# EasyEDA schematic SCH_自制基于ESP32的NES游戏掌机_2022-10-13.json

## Sheets
1 主板: TITLE: ESP32-NES游戏机; REV: 1.0; Date: 2020-06-22; Sheet: 1/1; Drawn By: micespring; Company: Your Company
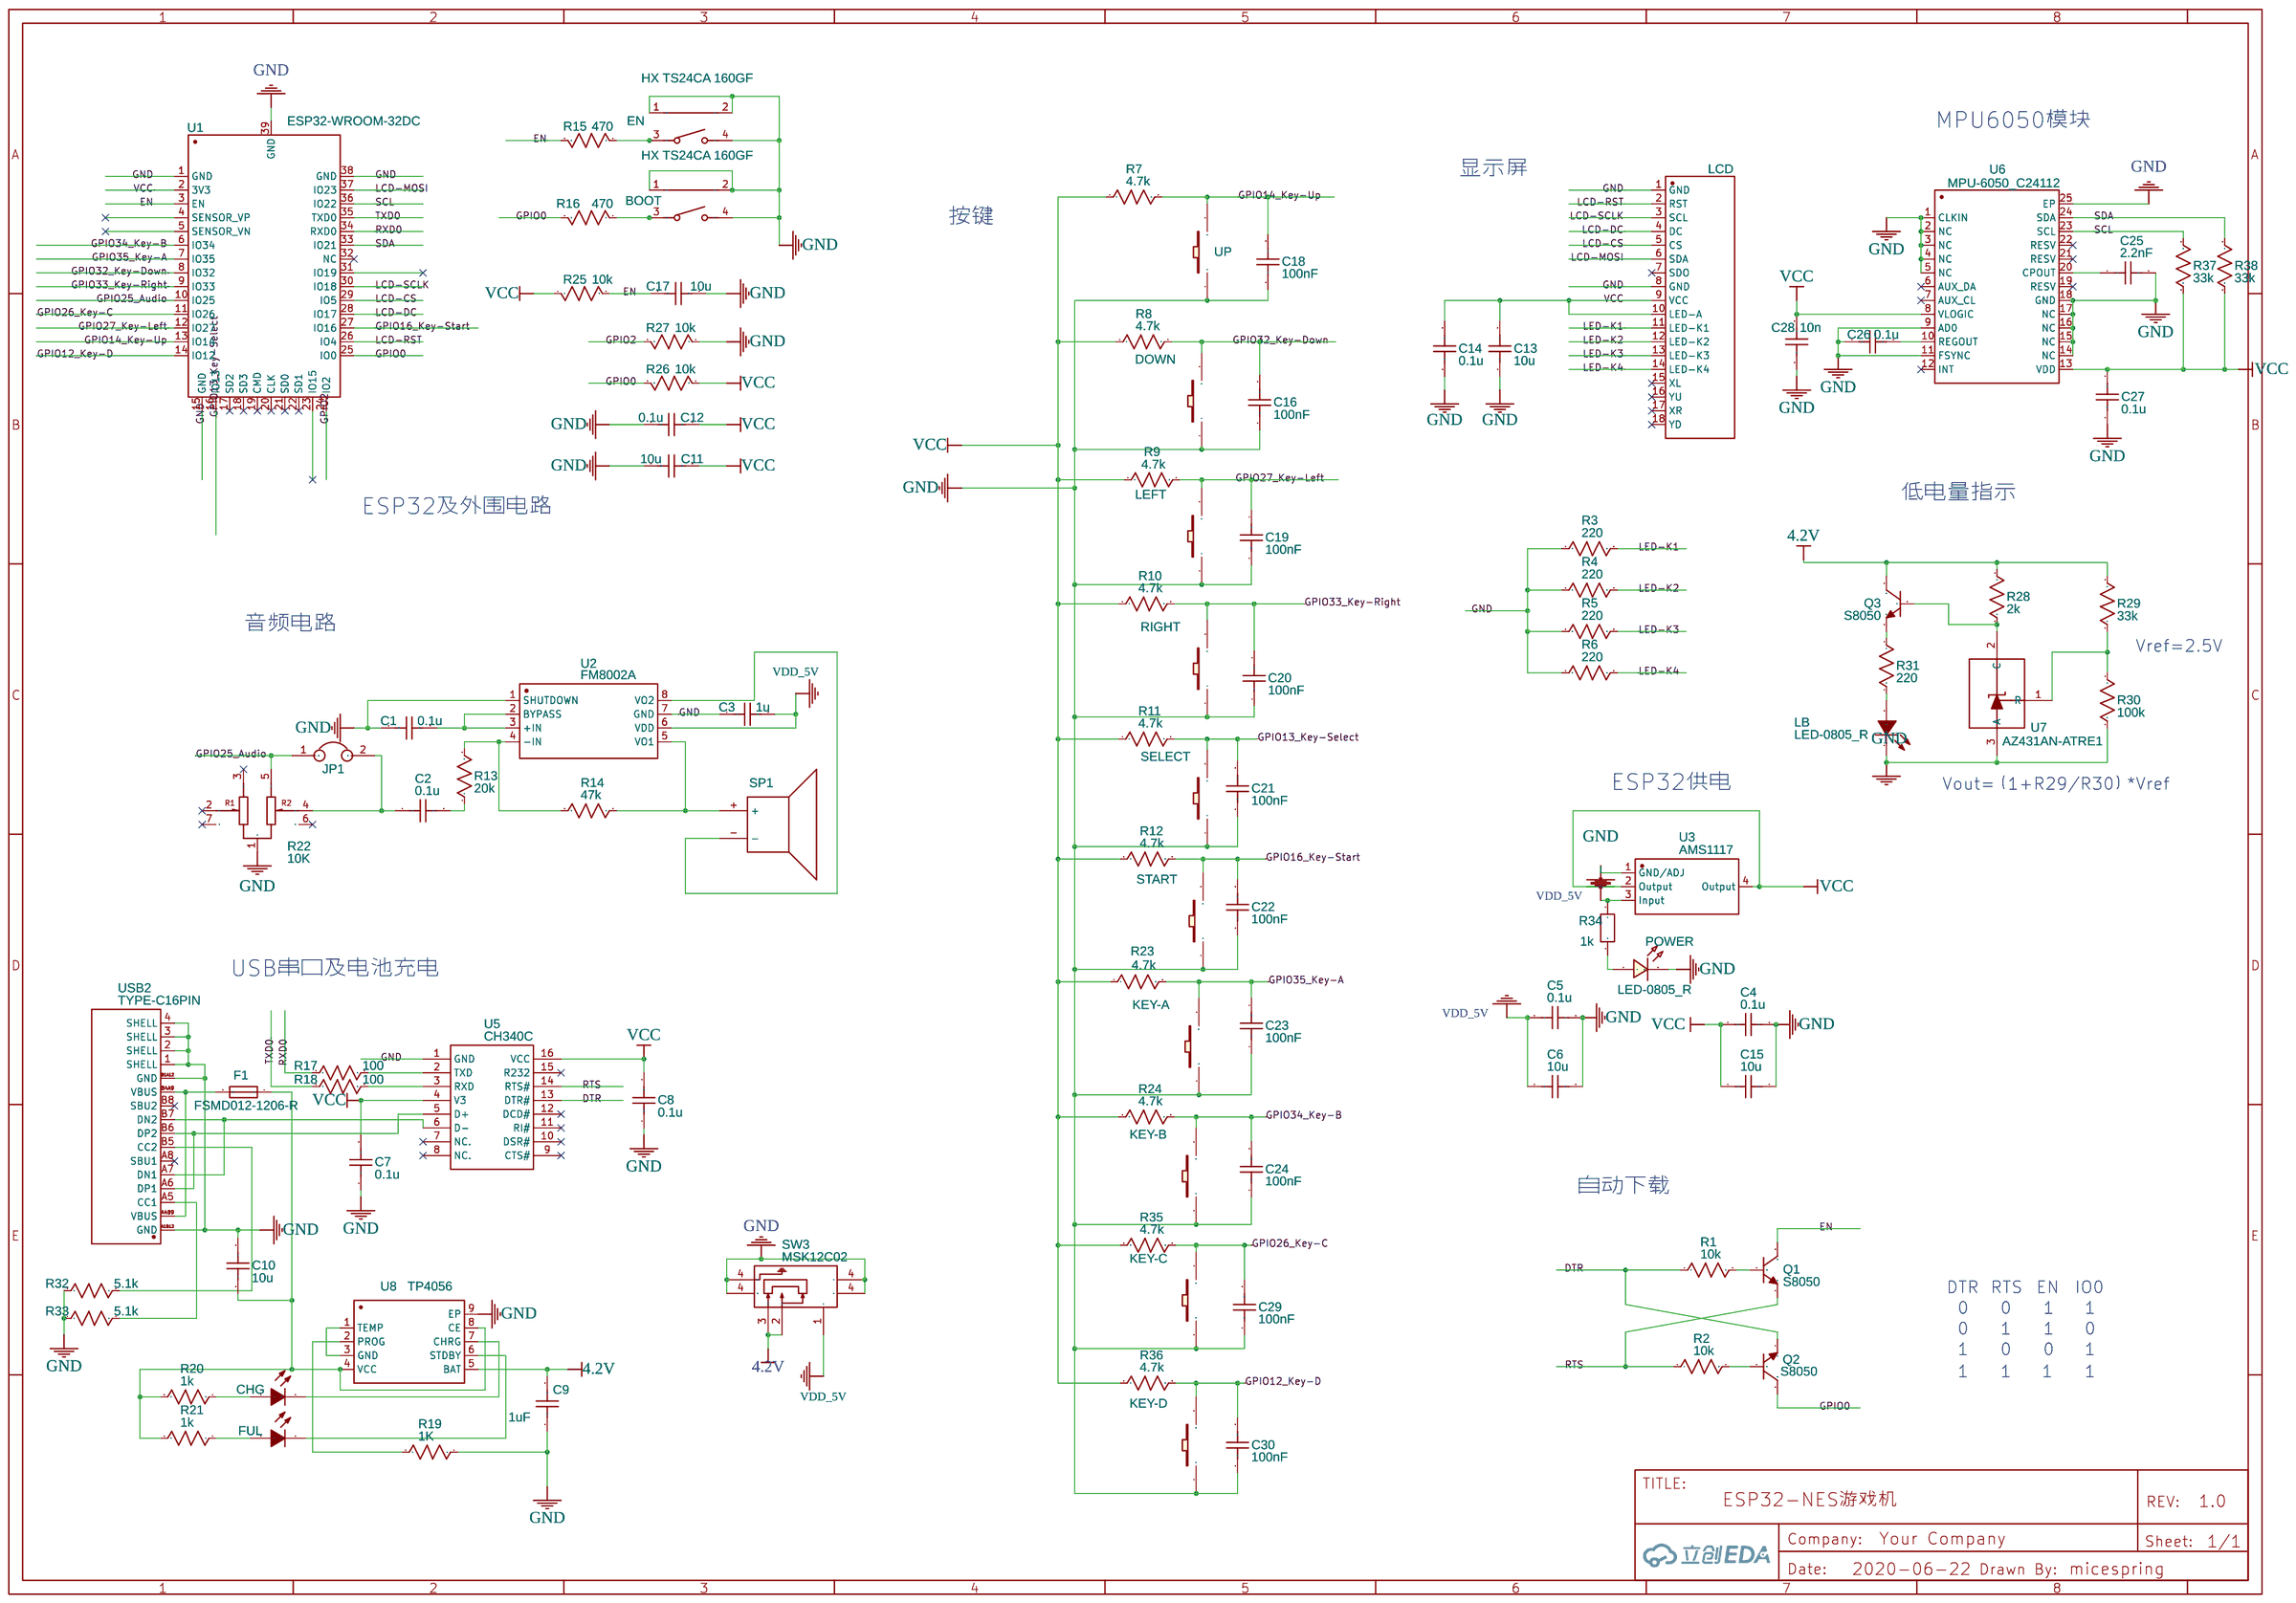
[diagram p0: 主板]
2 新主板
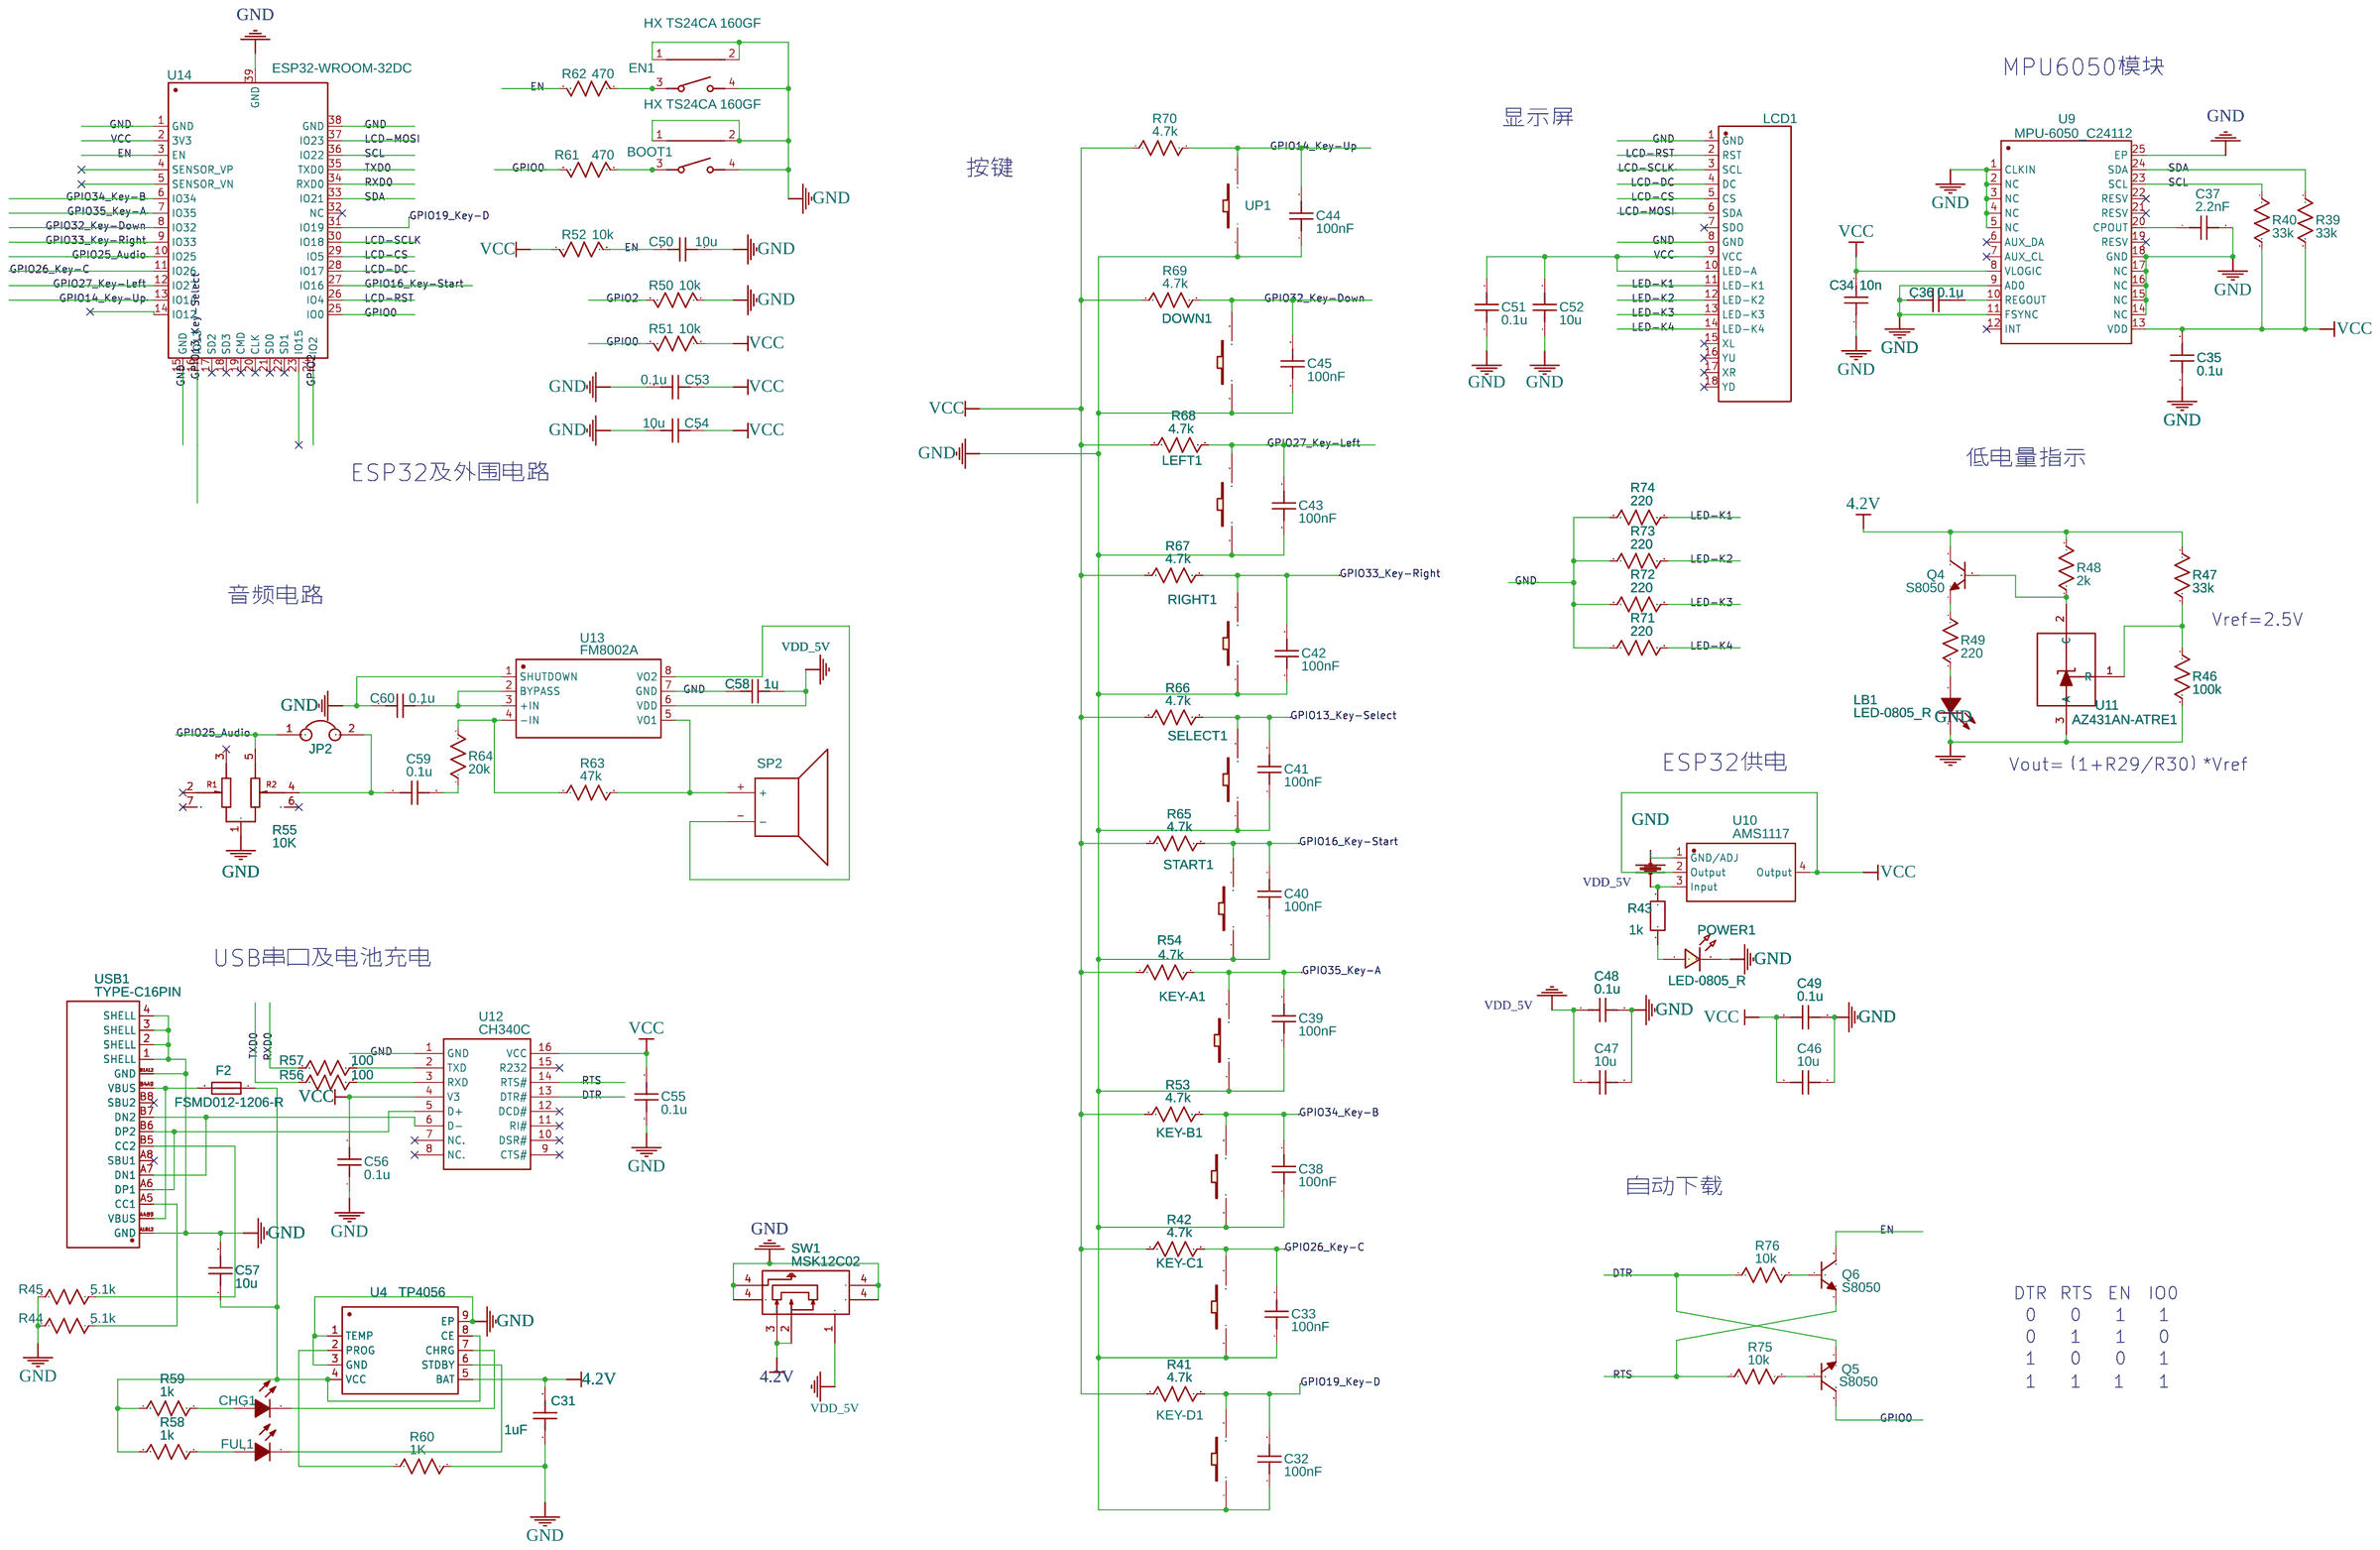
[diagram p1: 新主板]

## Parts
sheet 主板
BOOT  HX TS24CA 160GF  [SW-SMD_TS24CA]
C1  0.1u  [C0805]
C2  0.1u  [C0805]
C3  1u  [C0805]
C4  0.1u  [C0805]
C5  0.1u  [C0805]
C6  10u  [C0805]
C7  0.1u  [C0805]
C8  0.1u  [C0805]
C9  1uF  [C0805]
C10  10u  [C1206]
C11  10u  [C1206]
C12  0.1u  [C0805]
C13  10u  [C0805]
C14  0.1u  [C0805]
C15  10u  [C0805]
C16  100nF  [C0805]
C17  10u  [C0805]
C18  100nF  [C0805]
C19  100nF  [C0805]
C20  100nF  [C0805]
C21  100nF  [C0805]
C22  100nF  [C0805]
C23  100nF  [C0805]
C24  100nF  [C0805]
C25  2.2nF  [C0805]
C26  0.1u  [C0805]
C27  0.1u  [C0805]
C28  10n  [C0805]
C29  100nF  [C0805]
C30  100nF  [C0805]
CHG  17-21/BHC-XL2M2TY/3T  [LED0805_RED]
DOWN  K2-1817UQ-C4SW-01  [KEY-SMD_2P-L6.0-W6.0-P6.00]
EN  HX TS24CA 160GF  [SW-SMD_TS24CA]
F1  FSMD012-1206-R  [F1206]
FUL  17-21/BHC-XL2M2TY/3T  [LED0805_GREEN]
JP1  JUMPER  [JUMPER-0603]
KEY-A  K2-1817UQ-C4SW-01  [KEY-SMD_2P-L6.0-W6.0-P6.00]
KEY-B  K2-1817UQ-C4SW-01  [KEY-SMD_2P-L6.0-W6.0-P6.00]
KEY-C  K2-1817UQ-C4SW-01  [KEY-SMD_2P-L6.0-W6.0-P6.00]
KEY-D  K2-1817UQ-C4SW-01  [KEY-SMD_2P-L6.0-W6.0-P6.00]
LB  LED-0805_R  [LED0805_RED]
LCD  TFT_2.4_18P_SPI_ILI9341_240X320_65K_S  [TFT_2.4_18P_SPI_ILI9341_240X320_65K_S]
LEFT  K2-1817UQ-C4SW-01  [KEY-SMD_2P-L6.0-W6.0-P6.00]
POWER  LED-0805_R  [LED0805_RED]
Q1  S8050  [SOT-23-3_L2.9-W1.3-P1.90-LS2.4-TR]
Q2  S8050  [SOT-23-3_L2.9-W1.3-P1.90-LS2.4-TR]
Q3  S8050  [SOT-23-3_L2.9-W1.3-P1.90-LS2.4-TR]
R1  10k  [R0805]
R2  10k  [R0805]
R3  220  [R0805]
R4  220  [R0805]
R5  220  [R0805]
R6  220  [R0805]
R7  4.7k  [R0805]
R8  4.7k  [R0805]
R9  4.7k  [R0805]
R10  4.7k  [R0805]
R11  4.7k  [R0805]
R12  4.7k  [R0805]
R13  20k  [R0805]
R14  47k  [R0805]
R15  470  [R0805]
R16  470  [R0805]
R17  100  [R0805]
R18  100  [R0805]
R19  1K  [R0805]
R20  1k  [R0805]
R21  1k  [R0805]
R22  10K  [RES-TH_RK10J12E002L]
R23  4.7k  [R0805]
R24  4.7k  [R0805]
R25  10k  [R0805]
R26  10k  [R0805]
R27  10k  [R0805]
R28  2k  [R0805]
R29  33k  [R0805]
R30  100k  [R0805]
R31  220  [R0805]
R32  5.1k  [R0805]
R33  5.1k  [R0805]
R34  1k  [R0805]
R35  4.7k  [R0805]
R36  4.7k  [R0805]
R37  33k  [R0805]
R38  33k  [R0805]
RIGHT  K2-1817UQ-C4SW-01  [KEY-SMD_2P-L6.0-W6.0-P6.00]
SELECT  K2-1817UQ-C4SW-01  [KEY-SMD_2P-L6.0-W6.0-P6.00]
SP1  SPEAKER-FS-2308-P9.2  [SPEAKER-FS-2308-P9.2-PCB]
START  K2-1817UQ-C4SW-01  [KEY-SMD_2P-L6.0-W6.0-P6.00]
SW3  MSK12C02  [SW-TH_MSK12C02]
U1  ESP32-WROOM-32DC  [WIFIM-SMD_38P-L25.5-W18.0-P1.27]
U2  FM8002A  [SOP-8_L4.9-W3.9-P1.27-LS6.0-BL]
U3  AMS1117  [SOT-223-4_L6.5-W3.5-P2.30-LS7.0-BR]
U5  CH340C  [SOP-16_L10.0-W3.9-P1.27-LS6.0-BL]
U6  MPU-6050_C24112  [QFN-24_L4.0-W4.0-P0.50-BL-EP2.6]
U7  AZ431AN-ATRE1  [SOT-23-3_L2.9-W1.6-P1.90-LS2.8-BR]
U8  TP4056  [ESOP-8_L4.9-W3.9-P1.27-LS6.0-BL-EP]
UP  K2-1817UQ-C4SW-01  [KEY-SMD_2P-L6.0-W6.0-P6.00]
USB2  TYPE-C16PIN  [USB-C-SMD_TYPE-C16PIN]
sheet 新主板
BOOT1  HX TS24CA 160GF  [SW-SMD_TS24CA]
C31  1uF  [C0805]
C32  100nF  [C0805]
C33  100nF  [C0805]
C34  10n  [C0805]
C35  0.1u  [C0805]
C36  0.1u  [C0805]
C37  2.2nF  [C0805]
C38  100nF  [C0805]
C39  100nF  [C0805]
C40  100nF  [C0805]
C41  100nF  [C0805]
C42  100nF  [C0805]
C43  100nF  [C0805]
C44  100nF  [C0805]
C45  100nF  [C0805]
C46  10u  [C0805]
C47  10u  [C0805]
C48  0.1u  [C0805]
C49  0.1u  [C0805]
C50  10u  [C0805]
C51  0.1u  [C0805]
C52  10u  [C0805]
C53  0.1u  [C0805]
C54  10u  [C1206]
C55  0.1u  [C0805]
C56  0.1u  [C0805]
C57  10u  [C1206]
C58  1u  [C0805]
C59  0.1u  [C0805]
C60  0.1u  [C0805]
CHG1  17-21/BHC-XL2M2TY/3T  [LED0805_RED]
DOWN1  K2-1817UQ-C4SW-01  [KEY-SMD_2P-L6.0-W6.0-P6.00]
EN1  HX TS24CA 160GF  [SW-SMD_TS24CA]
F2  FSMD012-1206-R  [F1206]
FUL1  17-21/BHC-XL2M2TY/3T  [LED0805_GREEN]
JP2  JUMPER  [JUMPER-0603]
KEY-A1  K2-1817UQ-C4SW-01  [KEY-SMD_2P-L6.0-W6.0-P6.00]
KEY-B1  K2-1817UQ-C4SW-01  [KEY-SMD_2P-L6.0-W6.0-P6.00]
KEY-C1  K2-1817UQ-C4SW-01  [KEY-SMD_2P-L6.0-W6.0-P6.00]
KEY-D1  K2-1817UQ-C4SW-01  [KEY-SMD_2P-L6.0-W6.0-P6.00]
LB1  LED-0805_R  [LED0805_RED]
LCD1  TFT_2.4_18P_SPI_ILI9341_240X320_65K_S  [TFT_2.4_18P_SPI_ILI9341_240X320_65K_S]
LEFT1  K2-1817UQ-C4SW-01  [KEY-SMD_2P-L6.0-W6.0-P6.00]
POWER1  LED-0805_R  [LED0805_RED]
Q4  S8050  [SOT-23-3_L2.9-W1.3-P1.90-LS2.4-TR]
Q5  S8050  [SOT-23-3_L2.9-W1.3-P1.90-LS2.4-TR]
Q6  S8050  [SOT-23-3_L2.9-W1.3-P1.90-LS2.4-TR]
R39  33k  [R0805]
R40  33k  [R0805]
R41  4.7k  [R0805]
R42  4.7k  [R0805]
R43  1k  [R0805]
R44  5.1k  [R0805]
R45  5.1k  [R0805]
R46  100k  [R0805]
R47  33k  [R0805]
R48  2k  [R0805]
R49  220  [R0805]
R50  10k  [R0805]
R51  10k  [R0805]
R52  10k  [R0805]
R53  4.7k  [R0805]
R54  4.7k  [R0805]
R55  10K  [RES-TH_RK10J12E002L]
R56  100  [R0805]
R57  100  [R0805]
R58  1k  [R0805]
R59  1k  [R0805]
R60  1K  [R0805]
R61  470  [R0805]
R62  470  [R0805]
R63  47k  [R0805]
R64  20k  [R0805]
R65  4.7k  [R0805]
R66  4.7k  [R0805]
R67  4.7k  [R0805]
R68  4.7k  [R0805]
R69  4.7k  [R0805]
R70  4.7k  [R0805]
R71  220  [R0805]
R72  220  [R0805]
R73  220  [R0805]
R74  220  [R0805]
R75  10k  [R0805]
R76  10k  [R0805]
RIGHT1  K2-1817UQ-C4SW-01  [KEY-SMD_2P-L6.0-W6.0-P6.00]
SELECT1  K2-1817UQ-C4SW-01  [KEY-SMD_2P-L6.0-W6.0-P6.00]
SP2  SPEAKER-FS-2308-P9.2  [SPEAKER-FS-2308-P9.2-PCB]
START1  K2-1817UQ-C4SW-01  [KEY-SMD_2P-L6.0-W6.0-P6.00]
SW1  MSK12C02  [SW-TH_MSK12C02]
U4  TP4056  [ESOP-8_L4.9-W3.9-P1.27-LS6.0-BL-EP]
U9  MPU-6050_C24112  [QFN-24_L4.0-W4.0-P0.50-BL-EP2.6]
U10  AMS1117  [SOT-223-4_L6.5-W3.5-P2.30-LS7.0-BR]
U11  AZ431AN-ATRE1  [SOT-23-3_L2.9-W1.6-P1.90-LS2.8-BR]
U12  CH340C  [SOP-16_L10.0-W3.9-P1.27-LS6.0-BL]
U13  FM8002A  [SOP-8_L4.9-W3.9-P1.27-LS6.0-BL]
U14  ESP32-WROOM-32DC  [WIFIM-SMD_38P-L25.5-W18.0-P1.27]
UP1  K2-1817UQ-C4SW-01  [KEY-SMD_2P-L6.0-W6.0-P6.00]
USB1  TYPE-C16PIN  [USB-C-SMD_TYPE-C16PIN]

## Library data of the parts
BOOT BOOT1 EN EN1 = HX TS24CA 160GF: Supplier: LCSC; Supplier Part: C5143620; Manufacturer: hanxia(韩下); Manufacturer Part: HX TS24CA 160gf; link: https://atta.szlcsc.com/upload/public/pdf/source/20220824/A77D3460779E67918E68AFDA79B8989F.pdf; Contributor: lcsc
C1 C2 C7 C8 C12 C17 C50 C53 C55 C56 C59 C60 = C_0805_US: Supplier Part: C282732; Supplier: LCSC; Contributor: LCEDA_Lib; Manufacturer Part: TCC0805X7R104K500DT; Manufacturer: CCTC
C3 C58 = C_0805_US: Supplier Part: C89190; Supplier: LCSC; Contributor: LCEDA_Lib; Manufacturer Part: 0805B105K250NT; Manufacturer: FH
C4 C5 C48 C49 = C_0805_US: Contributor: LCEDA_Lib
C6 C9 C15 C16 C18-C47 = C_0603_US: Contributor: LCEDA_Lib
C10 C57 = Cap_1206_US: Manufacturer Part: CL31A106KAHNNNE; Supplier: LCSC; Manufacturer: SAMSUNG; Supplier Part: C9807
C11 C54 = C_0805_US: Supplier Part: C9807; Supplier: LCSC; Contributor: LCEDA_Lib; Manufacturer Part: CL31A106KAHNNNE; Manufacturer: SAMSUNG
C13 C52 = Cap_0805_US: Manufacturer Part: CC0805KRX5R6BB106; Supplier: LCSC; Manufacturer: YAGEO; Supplier Part: C272880
C14 C51 = Cap_0805_US: Manufacturer Part: TCC0805X7R104K500DT; Supplier: LCSC; Manufacturer: CCTC; Supplier Part: C282732
CHG CHG1 = -: Supplier: LCSC; Manufacturer: EVERLIGHT; image: //image.lceda.cn/szlcsc/C72035.jpg; Supplier Part: C72035; LCSC Assembly: Yes; SMT Type: Extend
DOWN DOWN1 KEY-A KEY-A1 KEY-B KEY-B1 KEY-C KEY-C1 KEY-D KEY-D1 LEFT LEFT1 RIGHT RIGHT1 SELECT SELECT1 START START1 UP UP1 = K2-1817UQ-C4SW-01: Supplier: LCSC; Manufacturer: HRO; Contributor: LCSC; Supplier Part: C128939; JLCPCB Part Class: Extended Part
F1 F2 = FSMD012-1206-R: Supplier: LCSC; Supplier Part: C220144; Manufacturer: Fuzetec Tech; Contributor: LCSC; JLCPCB Part Class: Extended Part
FUL FUL1 = -: Supplier: LCSC; Manufacturer: NATIONSTAR; Manufacturer Part: FC-2012UGK-520D5; image: //image.lceda.cn/szlcsc/C72035.jpg; Supplier Part: C84260; LCSC Assembly: Yes; SMT Type: Extend
JP1 JP2 = JUMPER
LB LB1 POWER POWER1 = LED-0805_R: Manufacturer: EVERLIGHT(台湾亿光); Manufacturer Part: 17-21SURC/S530-A3/TR8; Supplier Part: C72037; Contributor: LCEDA_Lib
LCD LCD1 = TFT_2.4_18P_SPI_ILI9341_240X320_65K_S: Contributor: micespring
Q1-Q6 = 2N3904(SOT-23): Supplier: LCSC; Manufacturer: KEC; Manufacturer Part: 2n3904S-RTK/PS; Supplier Part: C18536; SMT Type: SOT-23; Contributor: LCEDA_Lib
R1 R2 R25-R27 R50-R52 R75 R76 = R_0805_US: Supplier Part: C103904; Supplier: LCSC; Contributor: LCEDA_Lib; Manufacturer Part: RTT051002FTP; Manufacturer: RALEC
R3-R6 R71-R74 = R_0805_US: Supplier Part: C114519; Supplier: LCSC; Contributor: LCEDA_Lib; Manufacturer Part: RC0805FR-07220RL; Manufacturer: YAGEO
R7-R12 R23 R24 R35 R36 R41 R42 R53 R54 R65-R70 = R_0805_US: Supplier Part: C17673; Supplier: LCSC; Contributor: LCEDA_Lib; Manufacturer Part: 0805W8F4701T5E; Manufacturer: UniOhm
R13 R64 = R_0805_US: Supplier Part: C136576; Supplier: LCSC; Contributor: LCEDA_Lib; Manufacturer Part: RS-05K2002FT; Manufacturer: FH
R14 R63 = R_0805_US: Supplier Part: C136580; Supplier: LCSC; Contributor: LCEDA_Lib; Manufacturer Part: RS-05K4702FT; Manufacturer: FH
R15 R16 R61 R62 = R_0805_US: Supplier Part: C114564; Supplier: LCSC; Contributor: LCEDA_Lib; Manufacturer Part: RC0805FR-07470RL; Manufacturer: YAGEO
R17 R18 R32 R33 R44 R45 R56 R57 = R_0805_US: Supplier Part: C101403; Supplier: LCSC; Contributor: LCEDA_Lib; Manufacturer Part: CR0805F81000G; Manufacturer: LIZ
R19 R60 = Res_0805(1/8W)_US: Manufacturer Part: RS-05K3301FT; Supplier: LCSC; Manufacturer: Guangdong Fenghua Advanced Tech; Supplier Part: C294703
R20 R21 R58 R59 = Res_0805(1/8W)_US: Manufacturer Part: 0805W8F1001T5E; Supplier: LCSC; Manufacturer: UniOhm; Supplier Part: C17513
R22 R55 = RK10J12E002L: Supplier: LCSC; Supplier Part: C231765; Manufacturer: ALPS Electric; Contributor: LCSC
R28 R48 = Res_0805(1/8W)_US: Manufacturer Part: 0805W8F2001T5E; Supplier: LCSC; Manufacturer: UniOhm; Supplier Part: C17604
R29 R37-R40 R47 = Res_0805(1/8W)_US: Manufacturer Part: RS-05K3302FT; Supplier: LCSC; Manufacturer: FH; Supplier Part: C139883
R30 R46 = Res_0805(1/8W)_US: Manufacturer Part: 0805W8F1003T5E; Supplier: LCSC; Manufacturer: Uniroyal Elec; Supplier Part: C149504
R31 R49 = Res_0805(1/8W)_US: Manufacturer Part: RC0805FR-07220RL; Supplier: LCSC; Manufacturer: YAGEO; Supplier Part: C114519
R34 R43 = R_0805_EU: Contributor: LCEDA_Lib
SP1 SP2 = SPEAKER-FS-2308-P9.2: Contributor: SparkFun; Supplier: LCSC; Supplier Part: C482322
SW1 SW3 = MSK12C02: Supplier: LCSC; Supplier Part: C431540; Manufacturer: SHOU HAN; Contributor: LCSC; JLCPCB Part Class: Extended Part
U1 U14 = ESP32-WROOM-32DC: Supplier: LCSC; Supplier Part: C473013; Manufacturer: Espressif Systems; Contributor: LCSC
U2 U13 = FM8002A: Supplier: LCSC; Manufacturer: FM; Supplier Part: C94625; LCSC Assembly: Yes; SMT Type: Extend
U3 U10 = AMS1117-3.3_C369933: Supplier: LCSC; Supplier Part: C369933; Manufacturer: KEXIN; Manufacturer Part: AMS1117-3.3; Contributor: LCSC; JLCPCB Part Class: Extended Part
U5 U12 = CH340C: Supplier: LCSC; Manufacturer: WCH; Supplier Part: C84681; LCSC Assembly: Yes; SMT Type: Extend
U6 U9 = MPU-6050_C24112: sourceId: 1T5FDZYC8; Supplier: LCSC; Manufacturer: InvenSense; Manufacturer Part: MPU-6050; Supplier Part: C24112; JLCPCB Part Class: Basic Part
U7 U11 = AZ431AN-ATRE1: Supplier: LCSC; Manufacturer: DIODES; image: //image.lceda.cn/szlcsc/C84138.jpg; Supplier Part: C84138; LCSC Assembly: Yes; SMT Type: Extend
U4 U8 = TP4056_C725790: Supplier: LCSC; Supplier Part: C725790; Manufacturer: UMW(Youtai Semiconductor Co., Ltd.); Contributor: LCSC; JLCPCB Part Class: Extended Part
USB1 USB2 = TYPE-C16PIN: Supplier: LCSC; Supplier Part: C393939; Manufacturer: SHOU HAN; Contributor: LCSC; JLCPCB Part Class: Extended Part

## Nets
4.2V: C9.2 C31.2 Q3.3(C) Q4.3(C) R28.1 R29.1 R47.1 R48.1 SW1.2 SW1.3 SW3.2 SW3.3 U4.5(BAT) U8.5(BAT)
GND: BOOT.1 BOOT.2 BOOT.4 BOOT1.1 BOOT1.2 BOOT1.4 C1.1 C3.1 C4.2 C5.2 C6.2 C7.1 C8.1 C9.1 C10.2 C11.1 C12.1 C13.1 C14.1 C15.2 C16.1 C17.1 C18.1 C19.2 C20.1 C21.1 C22.1 C23.1 C24.1 C25.2 C26.1 C27.1 C28.1 C29.1 C30.1 C31.1 C32.1 C33.1 C34.1 C35.1 C36.1 C37.2 C38.1 C39.1 C40.1 C41.1 C42.1 C43.2 C44.1 C45.1 C46.2 C47.2 C48.2 C49.2 C50.1 C51.1 C52.1 C53.1 C54.1 C55.1 C56.1 C57.2 C58.1 C60.1 DOWN.1 DOWN1.1 EN.1 EN.2 EN.4 EN1.1 EN1.2 EN1.4 KEY-A.1 KEY-A1.1 KEY-B.1 KEY-B1.1 KEY-C.1 KEY-C1.1 KEY-D.1 KEY-D1.1 LB.2 LB1.2 LCD.1(GND) LCD.8(GND) LCD1.1(GND) LCD1.8(GND) LEFT.1 LEFT1.1 POWER.2 POWER1.2 R3.1 R4.1 R5.1 R6.1 R19.2 R22.1 R27.1 R30.2 R32.1 R33.1 R44.1 R45.1 R46.2 R50.1 R55.1 R60.2 R71.1 R72.1 R73.1 R74.1 RIGHT.1 RIGHT1.1 SELECT.1 SELECT1.1 START.1 START1.1 SW1.4 SW3.4 U1.1(GND) U1.15(GND) U1.38(GND) U1.39(GND) U2.1(SHUTDOWN) U2.7(GND) U3.1(GND/ADJ) U4.1(TEMP) U4.3(GND) U4.9(EP) U5.1(GND) U6.1(CLKIN) U6.2(NC) U6.3(NC) U6.4(NC) U6.5(NC) U6.9(AD0) U6.11(FSYNC) U6.14(NC) U6.15(NC) U6.16(NC) U6.17(NC) U6.18(GND) U6.25(EP) U7.3(A) U8.9(EP) U9.1(CLKIN) U9.2(NC) U9.3(NC) U9.4(NC) U9.5(NC) U9.9(AD0) U9.11(FSYNC) U9.14(NC) U9.15(NC) U9.16(NC) U9.17(NC) U9.18(GND) U9.25(EP) U10.1(GND/ADJ) U11.3(A) U12.1(GND) U13.1(SHUTDOWN) U13.7(GND) U14.1(GND) U14.15(GND) U14.38(GND) U14.39(GND) UP.1 UP1.1 USB1.1(SHELL) USB1.2(SHELL) USB1.3(SHELL) USB1.4(SHELL) USB1.A1B12(GND) USB1.B1A12(GND) USB2.1(SHELL) USB2.2(SHELL) USB2.3(SHELL) USB2.4(SHELL) USB2.A1B12(GND) USB2.B1A12(GND)
VCC: C4.1 C7.2 C8.2 C11.2 C12.2 C13.2 C14.2 C15.1 C27.2 C28.2 C34.2 C35.2 C46.1 C49.1 C51.2 C52.2 C53.2 C54.2 C55.2 C56.2 LCD.9(VCC) LCD.10(LED-A) LCD1.9(VCC) LCD1.10(LED-A) R7.1 R8.1 R9.1 R10.1 R11.1 R12.1 R23.1 R24.1 R25.1 R26.1 R35.1 R36.1 R37.2 R38.2 R39.2 R40.2 R41.1 R42.1 R51.1 R52.1 R53.1 R54.1 R65.1 R66.1 R67.1 R68.1 R69.1 R70.1 U1.2(3V3) U3.2(Output) U3.4(Output) U5.4(V3) U5.16(VCC) U6.8(VLOGIC) U6.13(VDD) U9.8(VLOGIC) U9.13(VDD) U10.2(Output) U10.4(Output) U12.4(V3) U12.16(VCC) U14.2(3V3)
VDD_5V: C3.2 C5.1 C6.1 C47.1 C48.1 C58.2 R34.2 R43.2 SW1.1 SW3.1 U2.6(VDD) U3.3(Input) U10.3(Input) U13.6(VDD)
DTR: Q2.1(E) Q5.1(E) R1.1 R76.1 U5.13(DTR#) U12.13(DTR#)
EN: C17.2 C50.2 Q1.3(C) Q6.3(C) R15.2 R25.2 R52.2 R62.2 U1.3(EN) U14.3(EN)
GPIO0: Q2.3(C) Q5.3(C) R16.2 R26.2 R51.2 R61.2 U1.25(IO0) U14.25(IO0)
GPIO2: R27.2 R50.2 U1.24(IO2) U14.24(IO2)
GPIO12_Key-D: C30.2 KEY-D.2 R36.2 U1.14(IO12)
GPIO13_Key-Select: C21.2 C41.2 R11.2 R66.2 SELECT.2 SELECT1.2 U1.16(IO13) U14.16(IO13)
GPIO14_Key-Up: C18.2 C44.2 R7.2 R70.2 U1.13(IO14) U14.13(IO14) UP.2 UP1.2
GPIO16_Key-Start: C22.2 C40.2 R12.2 R65.2 START.2 START1.2 U1.27(IO16) U14.27(IO16)
GPIO19_Key-D: C32.2 KEY-D1.2 R41.2 U14.31(IO19)
GPIO25_Audio: JP1.1 JP2.1 R22.5 R55.5 U1.10(IO25) U14.10(IO25)
GPIO26_Key-C: C29.2 C33.2 KEY-C.2 KEY-C1.2 R35.2 R42.2 U1.11(IO26) U14.11(IO26)
GPIO27_Key-Left: C19.1 C43.1 LEFT.2 LEFT1.2 R9.2 R68.2 U1.12(IO27) U14.12(IO27)
GPIO32_Key-Down: C16.2 C45.2 DOWN.2 DOWN1.2 R8.2 R69.2 U1.8(IO32) U14.8(IO32)
GPIO33_Key-Right: C20.2 C42.2 R10.2 R67.2 RIGHT.2 RIGHT1.2 U1.9(IO33) U14.9(IO33)
GPIO34_Key-B: C24.2 C38.2 KEY-B.2 KEY-B1.2 R24.2 R53.2 U1.6(IO34) U14.6(IO34)
GPIO35_Key-A: C23.2 C39.2 KEY-A.2 KEY-A1.2 R23.2 R54.2 U1.7(IO35) U14.7(IO35)
LCD-CS: LCD.5(CS) LCD1.5(CS) U1.29(IO5) U14.29(IO5)
LCD-DC: LCD.4(DC) LCD1.4(DC) U1.28(IO17) U14.28(IO17)
LCD-MOSI: LCD.6(SDA) LCD1.6(SDA) U1.37(IO23) U14.37(IO23)
LCD-RST: LCD.2(RST) LCD1.2(RST) U1.26(IO4) U14.26(IO4)
LCD-SCLK: LCD.3(SCL) LCD1.3(SCL) U1.30(IO18) U14.30(IO18)
LED-K1: LCD.11(LED-K1) LCD1.11(LED-K1) R3.2 R74.2
LED-K2: LCD.12(LED-K2) LCD1.12(LED-K2) R4.2 R73.2
LED-K3: LCD.13(LED-K3) LCD1.13(LED-K3) R5.2 R72.2
LED-K4: LCD.14(LED-K4) LCD1.14(LED-K4) R6.2 R71.2
RTS: Q1.1(E) Q6.1(E) R2.1 R75.1 U5.14(RTS#) U12.14(RTS#)
RXD0: R17.1 R57.1 U1.34(RXD0) U14.34(RXD0)
SCL: R37.1 R40.1 U1.36(IO22) U6.23(SCL) U9.23(SCL) U14.36(IO22)
SDA: R38.1 R39.1 U1.33(IO21) U6.24(SDA) U9.24(SDA) U14.33(IO21)
TXD0: R18.1 R56.1 U1.35(TXD0) U14.35(TXD0)
Net-(BOOT1-3): BOOT1.3 R61.1
Net-(BOOT-3): BOOT.3 R16.1
Net-(C1-2): C1.2 U2.2(BYPASS) U2.3(+IN)
Net-(C2-1): C2.1 JP1.2 R22.4
Net-(C2-2): C2.2 R13.1
Net-(C10-1): C10.1 F1.1 R20.2 R21.2 U8.4(VCC) U8.8(CE)
Net-(C25-1): C25.1 U6.20(CPOUT)
Net-(C26-2): C26.2 U6.10(REGOUT)
Net-(C36-2): C36.2 U9.10(REGOUT)
Net-(C37-1): C37.1 U9.20(CPOUT)
Net-(C57-1): C57.1 F2.1 R58.2 R59.2 U4.4(VCC) U4.8(CE)
Net-(C59-1): C59.1 JP2.2 R55.4
Net-(C59-2): C59.2 R64.1
Net-(C60-2): C60.2 U13.2(BYPASS) U13.3(+IN)
Net-(CHG1-1): CHG1.1(A) R59.1
Net-(CHG1-2): CHG1.2(C) U4.7(CHRG)
Net-(CHG-1): CHG.1(A) R20.1
Net-(CHG-2): CHG.2(C) U8.7(CHRG)
Net-(EN1-3): EN1.3 R62.1
Net-(EN-3): EN.3 R15.1
Net-(F1-2): F1.2 USB2.A4B9(VBUS) USB2.B4A9(VBUS)
Net-(F2-2): F2.2 USB1.A4B9(VBUS) USB1.B4A9(VBUS)
Net-(FUL1-1): FUL1.1(A) R58.1
Net-(FUL1-2): FUL1.2(C) U4.6(STDBY)
Net-(FUL-1): FUL.1(A) R21.1
Net-(FUL-2): FUL.2(C) U8.6(STDBY)
Net-(LB1-1): LB1.1 R49.2
Net-(LB-1): LB.1 R31.2
Net-(POWER1-1): POWER1.1 R43.1
Net-(POWER-1): POWER.1 R34.1
Net-(Q1-2): Q1.2(B) R1.2
Net-(Q2-2): Q2.2(B) R2.2
Net-(Q3-1): Q3.1(E) R31.1
Net-(Q3-2): Q3.2(B) R28.2 U7.2(C)
Net-(Q4-1): Q4.1(E) R49.1
Net-(Q4-2): Q4.2(B) R48.2 U11.2(C)
Net-(Q5-2): Q5.2(B) R75.2
Net-(Q6-2): Q6.2(B) R76.2
Net-(R13-2): R13.2 R14.1 U2.4(-IN)
Net-(R14-2): R14.2 SP1.+ U2.5(VO1)
Net-(R17-2): R17.2 U5.2(TXD)
Net-(R18-2): R18.2 U5.3(RXD)
Net-(R19-1): R19.1 U8.2(PROG)
Net-(R29-2): R29.2 R30.1 U7.1(R)
Net-(R32-2): R32.2 USB2.B5(CC2)
Net-(R33-2): R33.2 USB2.A5(CC1)
Net-(R44-2): R44.2 USB1.A5(CC1)
Net-(R45-2): R45.2 USB1.B5(CC2)
Net-(R46-1): R46.1 R47.2 U11.1(R)
Net-(R56-2): R56.2 U12.3(RXD)
Net-(R57-2): R57.2 U12.2(TXD)
Net-(R60-1): R60.1 U4.2(PROG)
Net-(R63-1): R63.1 R64.2 U13.4(-IN)
Net-(R63-2): R63.2 SP2.+ U13.5(VO1)
Net-(SP1--): SP1.- U2.8(VO2)
Net-(SP2--): SP2.- U13.8(VO2)
Net-(U5-5): U5.5(D+) USB2.A6(DP1) USB2.B6(DP2)
Net-(U5-6): U5.6(D-) USB2.A7(DN1) USB2.B7(DN2)
Net-(U8-1): U8.1(TEMP) U8.3(GND)
Net-(U12-5): U12.5(D+) USB1.A6(DP1) USB1.B6(DP2)
Net-(U12-6): U12.6(D-) USB1.A7(DN1) USB1.B7(DN2)

Not connected (* = marked no-connect by the designer): LCD 7(SDO)* 15(XL)* 16(YU)* 17(XR)* 18(YD)*; LCD1 7(SDO)* 15(XL)* 16(YU)* 17(XR)* 18(YD)*; R22 2* 3* 6(EH)* 7(EH)*; R55 2* 3* 6(EH)* 7(EH)*; U1 4(SENSOR_VP) 5(SENSOR_VN) 17(SD2)* 18(SD3)* 19(CMD)* 20(CLK)* 21(SD0)* 22(SD1)* 23(IO15) 31(IO19) 32(NC)*; U5 7(NC.)* 8(NC.)* 9(CTS#)* 10(DSR#)* 11(RI#)* 12(DCD#)* 15(R232)*; U6 6(AUX_DA)* 7(AUX_CL)* 12(INT)* 19(RESV)* 21(RESV)* 22(RESV)*; U9 6(AUX_DA)* 7(AUX_CL)* 12(INT)* 19(RESV)* 21(RESV)* 22(RESV)*; U12 7(NC.)* 8(NC.)* 9(CTS#)* 10(DSR#)* 11(RI#)* 12(DCD#)* 15(R232)*; U14 4(SENSOR_VP) 5(SENSOR_VN) 14(IO12) 17(SD2)* 18(SD3)* 19(CMD)* 20(CLK)* 21(SD0)* 22(SD1)* 23(IO15) 32(NC)*; USB1 A8(SBU1)* B8(SBU2)*; USB2 A8(SBU1)* B8(SBU2)*

## Notes on the sheets
sheet 1
- MPU6050模块
- 显示屏
- 按键
- 低电量指示
- ESP32及外围电路
- 音频电路
- Vref=2.5V
- ESP32供电
- Vout=（1+R29/R30）*Vref
- USB串口及电池充电
- 自动下载
- DTR
- RTS
- EN
- IO0
- 0
- 0
- 1
- 1
- 0
- 1
- 1
- 0
- 1
- 0
- 0
- 1
- 1
- 1
- 1
- 1
sheet 2
- MPU6050模块
- 显示屏
- 按键
- ESP32及外围电路
- 低电量指示
- 音频电路
- Vref=2.5V
- ESP32供电
- Vout=（1+R29/R30）*Vref
- USB串口及电池充电
- 自动下载
- DTR
- RTS
- EN
- IO0
- 0
- 0
- 1
- 1
- 0
- 1
- 1
- 0
- 1
- 0
- 0
- 1
- 1
- 1
- 1
- 1
